# EAGLE schematic voltagedivider (EAGLE 8.6.0)
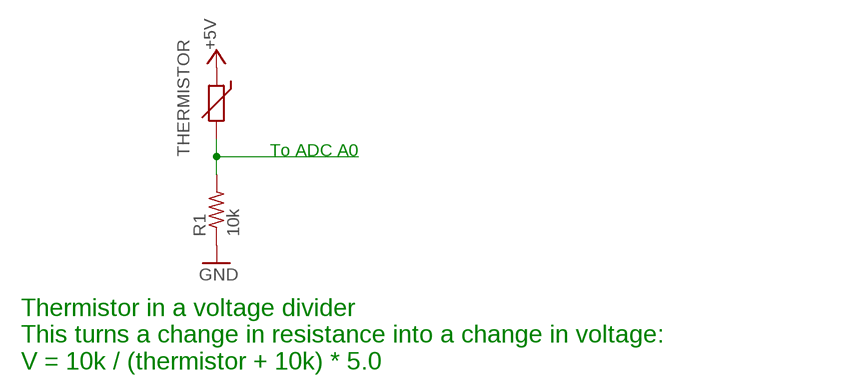
[diagram p0: schematic, sheet 1]

## Parts
R1  10k  R-US_R0603  [R0603]
THERMISTOR  THERMISTOR_R-5  [R-5]

## Nets
+5V: THERMISTOR.1
GND: R1.1
N$1: R1.2 THERMISTOR.2

## Notes on the sheet
- To ADC A0
- Thermistor in a voltage divider
  This turns a change in resistance into a change in voltage:
  V = 10k / (thermistor + 10k) * 5.0

## Library data of the parts
R1 = rcl:R-US_: RESISTOR, American symbol; SPICEPREFIX: R
THERMISTOR = discrete:THERMISTOR_: Thermo Resistor